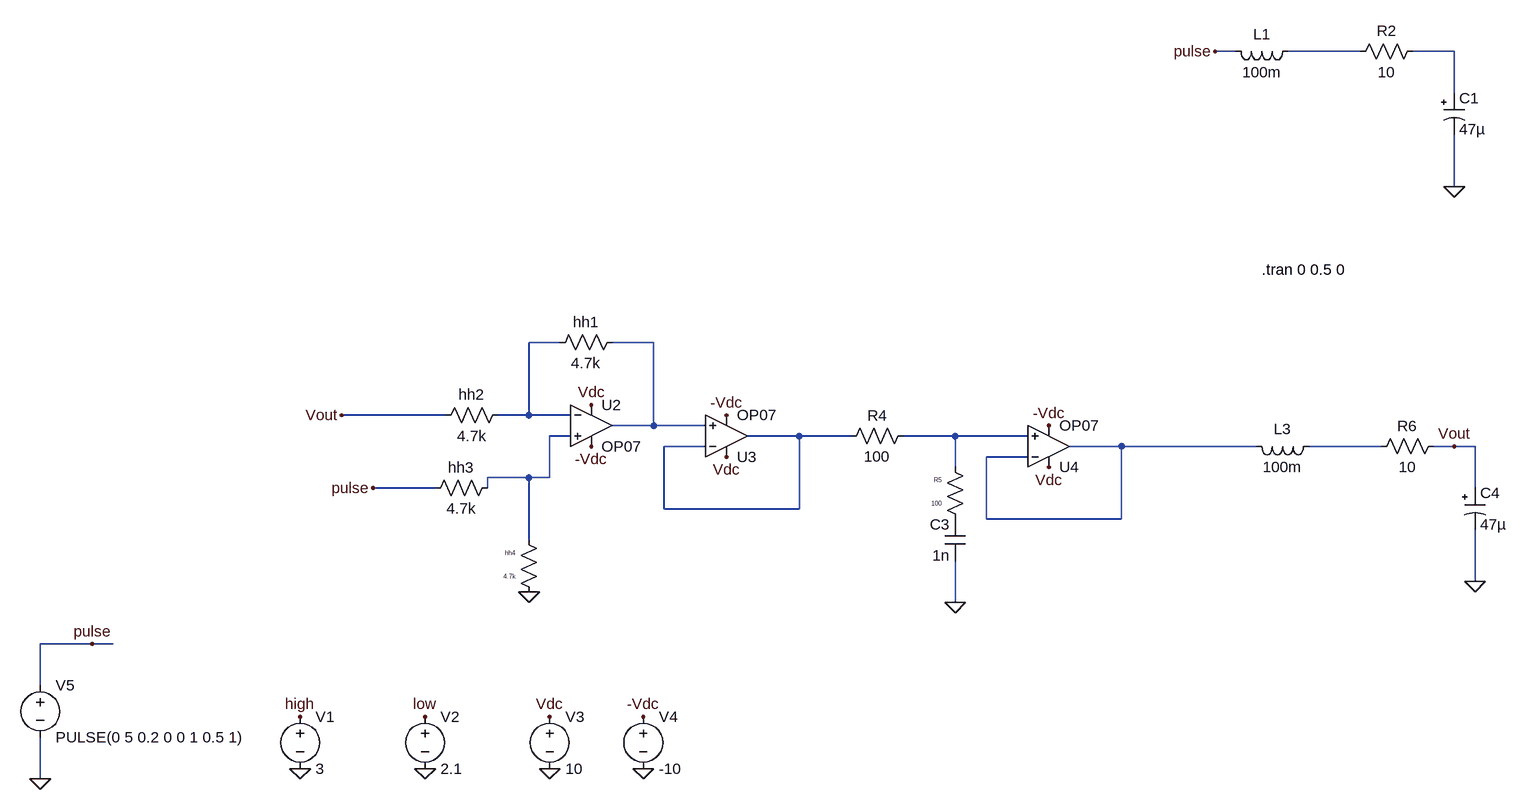
[diagram p0: schematic lag.asc]
lag.asc, the LTspice schematic file:
Version 4
SHEET 1 1948 976
WIRE 1088 -256 1056 -256
WIRE 1280 -256 1168 -256
WIRE 1424 -256 1360 -256
WIRE 1424 -192 1424 -256
WIRE 1424 -48 1424 -128
WIRE 48 192 0 192
WIRE 192 192 128 192
WIRE -128 304 -288 304
WIRE 0 304 0 192
WIRE 0 304 -48 304
WIRE 64 304 0 304
WIRE 192 320 192 192
WIRE 192 320 128 320
WIRE 272 320 192 320
WIRE 64 336 32 336
WIRE 416 336 336 336
WIRE 496 336 416 336
WIRE 656 336 576 336
WIRE 768 336 656 336
WIRE 272 352 208 352
WIRE 912 352 832 352
WIRE 1120 352 912 352
WIRE 1312 352 1200 352
WIRE 1424 352 1392 352
WIRE 1456 352 1424 352
WIRE 768 368 704 368
WIRE 656 384 656 336
WIRE 0 400 -64 400
WIRE 32 400 32 336
WIRE 32 400 0 400
WIRE -144 416 -240 416
WIRE -64 416 -64 400
WIRE 1456 416 1456 352
WIRE 208 448 208 352
WIRE 416 448 416 336
WIRE 416 448 208 448
WIRE 704 464 704 368
WIRE 912 464 912 352
WIRE 912 464 704 464
WIRE 0 496 0 400
WIRE 1456 560 1456 480
WIRE 656 592 656 528
WIRE -672 656 -752 656
WIRE -640 656 -672 656
WIRE -752 720 -752 656
WIRE -752 864 -752 800
FLAG -352 848 0
FLAG -352 768 high
FLAG -160 848 0
FLAG -160 768 low
FLAG 32 848 0
FLAG 32 768 Vdc
FLAG 176 848 0
FLAG 176 768 -Vdc
FLAG -752 864 0
FLAG -672 656 pulse
FLAG 0 576 0
FLAG 96 288 Vdc
FLAG -240 416 pulse
FLAG 96 352 -Vdc
FLAG 304 368 Vdc
FLAG 304 304 -Vdc
FLAG -288 304 Vout
FLAG 656 592 0
FLAG 1456 560 0
FLAG 1424 352 Vout
FLAG 1424 -48 0
FLAG 1056 -256 pulse
FLAG 800 384 Vdc
FLAG 800 320 -Vdc
SYMBOL voltage -352 752 R0
SYMATTR InstName V1
SYMATTR Value 3
SYMBOL voltage -160 752 R0
SYMATTR InstName V2
SYMATTR Value 2.1
SYMBOL voltage 32 752 R0
SYMATTR InstName V3
SYMATTR Value 10
SYMBOL voltage 176 752 R0
SYMATTR InstName V4
SYMATTR Value -10
SYMBOL voltage -752 704 R0
SYMATTR InstName V5
SYMATTR Value PULSE(0 5 0.2 0 0 1 0.5 1)
SYMBOL res 144 176 R90
WINDOW 0 0 56 VBottom 2
WINDOW 3 32 56 VTop 2
SYMATTR InstName hh1
SYMATTR Value 4.7k
SYMBOL res -32 288 R90
WINDOW 0 0 56 VBottom 2
WINDOW 3 32 56 VTop 2
SYMATTR InstName hh2
SYMATTR Value 4.7k
SYMBOL res -48 400 R90
WINDOW 0 0 56 VBottom 2
WINDOW 3 32 56 VTop 2
SYMATTR InstName hh3
SYMATTR Value 4.7k
SYMBOL res 16 592 R180
WINDOW 0 36 76 Left 0
WINDOW 3 36 40 Left 0
SYMATTR InstName hh4
SYMATTR Value 4.7k
SYMBOL Opamps/OP07 96 256 R0
SYMATTR InstName U2
SYMBOL Opamps/OP07 304 400 M180
SYMATTR InstName U3
SYMBOL res 592 320 R90
WINDOW 0 0 56 VBottom 2
WINDOW 3 32 56 VTop 2
SYMATTR InstName R4
SYMATTR Value 100
SYMBOL res 672 480 R180
WINDOW 0 36 76 Left 0
WINDOW 3 36 40 Left 0
SYMATTR InstName R5
SYMATTR Value 100
SYMBOL cap 672 528 R180
WINDOW 0 24 56 Left 2
WINDOW 3 24 8 Left 2
SYMATTR InstName C3
SYMATTR Value 1n
SYMBOL res 1408 336 R90
WINDOW 0 0 56 VBottom 2
WINDOW 3 32 56 VTop 2
SYMATTR InstName R6
SYMATTR Value 10
SYMBOL ind 1216 336 R90
WINDOW 0 5 56 VBottom 2
WINDOW 3 32 56 VTop 2
SYMATTR InstName L3
SYMATTR Value 100m
SYMBOL polcap 1440 416 R0
SYMATTR InstName C4
SYMATTR Value 47µ
SYMBOL res 1376 -272 R90
WINDOW 0 0 56 VBottom 2
WINDOW 3 32 56 VTop 2
SYMATTR InstName R2
SYMATTR Value 10
SYMBOL ind 1184 -272 R90
WINDOW 0 5 56 VBottom 2
WINDOW 3 32 56 VTop 2
SYMATTR InstName L1
SYMATTR Value 100m
SYMBOL polcap 1408 -192 R0
SYMATTR InstName C1
SYMATTR Value 47µ
SYMBOL Opamps/OP07 800 416 M180
SYMATTR InstName U4
TEXT 1128 80 Left 2 !.tran 0 0.5 0

The netlist it stands for:
* lag.asc
V1 high 0 3
V2 low 0 2.1
V3 Vdc 0 10
V4 -Vdc 0 -10
V5 pulse 0 PULSE(0 5 0.2 0 0 1 0.5 1)
R§hh1 N004 N003 4.7k
R§hh2 N003 Vout 4.7k
R§hh3 N005 pulse 4.7k
R§hh4 0 N005 4.7k
XU2 N005 N003 Vdc -Vdc N004 LT1001  ; OP07, pins In+ In- V+ V- OUT
XU3 N004 N006 Vdc -Vdc N006 LT1001  ; OP07, pins In+ In- V+ V- OUT
R4 N007 N006 100
R5 P001 N007 100
C3 0 P001 1n
R6 Vout N009 10
L3 N009 N008 100m
C4 Vout 0 47µ
R2 N002 N001 10
L1 N001 pulse 100m
C1 N002 0 47µ
XU4 N007 N008 Vdc -Vdc N008 LT1001  ; OP07, pins In+ In- V+ V- OUT
.tran 0 0.5 0
.lib LTC.lib
.backanno
.end